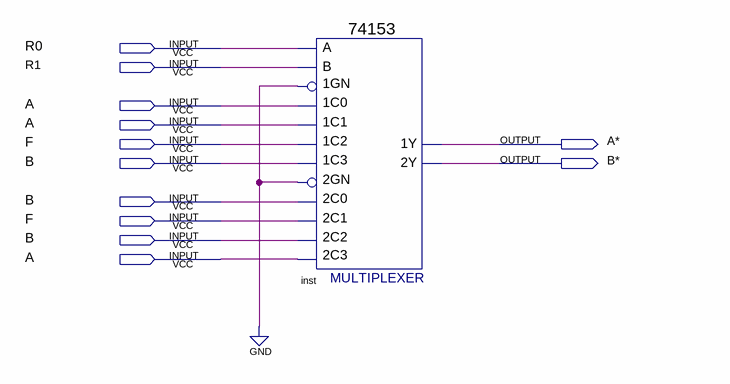
[diagram p0: schematic sheet]
// Quartus schematic Route1.bdf as structural Verilog: 1 symbols, 12 pins
module Route1 (
  input  R0,
  input  R1,
  input  A,
  input  F,
  input  B,
  output \A* ,
  output \B* 
);

  \74153  inst (
    .\1C1 (A), .\1GN (1'b0), .\1C0 (A), .\2C0 (B), .\2GN (1'b0), .\2C2 (B), .\1C2 (F), .\1C3 (B), .B(R1),
    .A(R0), .\2C1 (F), .\2C3 (A), .\1Y (\A* ), .\2Y (\B* ));
endmodule
